# Altium schematic sheet SCH_Main.SchDoc
size 254 x 127 mm
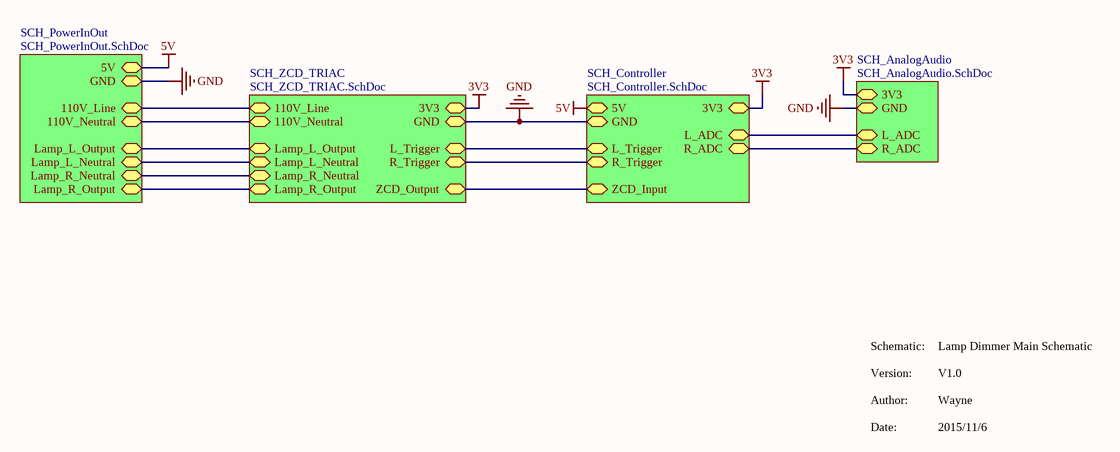
[diagram p0: SCH_Main.SchDoc]

## Sub-sheets
SCH_AnalogAudio = SCH_AnalogAudio.SchDoc: 3V3, GND, L_ADC, R_ADC
SCH_Controller = SCH_Controller.SchDoc: 5V, GND, 3V3, L_ADC, R_ADC, L_Trigger, R_Trigger, ZCD_Input
SCH_PowerInOut = SCH_PowerInOut.SchDoc: 110V_Line, 110V_Neutral, 5V, GND, Lamp_L_Neutral, Lamp_L_Output, Lamp_R_Neutral, Lamp_R_Output
SCH_ZCD_TRIAC = SCH_ZCD_TRIAC.SchDoc: 3V3, GND, 110V_Line, L_Trigger, R_Trigger, Lamp_L_Neutral, Lamp_L_Output, 110V_Neutral, Lamp_R_Output, Lamp_R_Neutral, ZCD_Output

## Nets
3V3: sheet SCH_Controller/3V3, sheet SCH_ZCD_TRIAC/3V3, sheet SCH_AnalogAudio/3V3
5V: sheet SCH_Controller/5V, sheet SCH_PowerInOut/5V
GND: sheet SCH_Controller/GND, sheet SCH_PowerInOut/GND, sheet SCH_ZCD_TRIAC/GND, sheet SCH_AnalogAudio/GND
(unnamed): sheet SCH_Controller/L_ADC, sheet SCH_AnalogAudio/L_ADC
(unnamed): sheet SCH_Controller/R_ADC, sheet SCH_AnalogAudio/R_ADC
(unnamed): sheet SCH_Controller/L_Trigger, sheet SCH_ZCD_TRIAC/L_Trigger
(unnamed): sheet SCH_Controller/R_Trigger, sheet SCH_ZCD_TRIAC/R_Trigger
(unnamed): sheet SCH_Controller/ZCD_Input, sheet SCH_ZCD_TRIAC/ZCD_Output
(unnamed): sheet SCH_PowerInOut/110V_Line, sheet SCH_ZCD_TRIAC/110V_Line
(unnamed): sheet SCH_PowerInOut/110V_Neutral, sheet SCH_ZCD_TRIAC/110V_Neutral
(unnamed): sheet SCH_PowerInOut/Lamp_L_Neutral, sheet SCH_ZCD_TRIAC/Lamp_L_Neutral
(unnamed): sheet SCH_PowerInOut/Lamp_L_Output, sheet SCH_ZCD_TRIAC/Lamp_L_Output
(unnamed): sheet SCH_PowerInOut/Lamp_R_Neutral, sheet SCH_ZCD_TRIAC/Lamp_R_Neutral
(unnamed): sheet SCH_PowerInOut/Lamp_R_Output, sheet SCH_ZCD_TRIAC/Lamp_R_Output

## Notes on the sheet
- Lamp Dimmer Main Schematic
- Schematic:
  Version:
  Author:
  Date:
- Wayne
- V1.0
- 2015/11/6